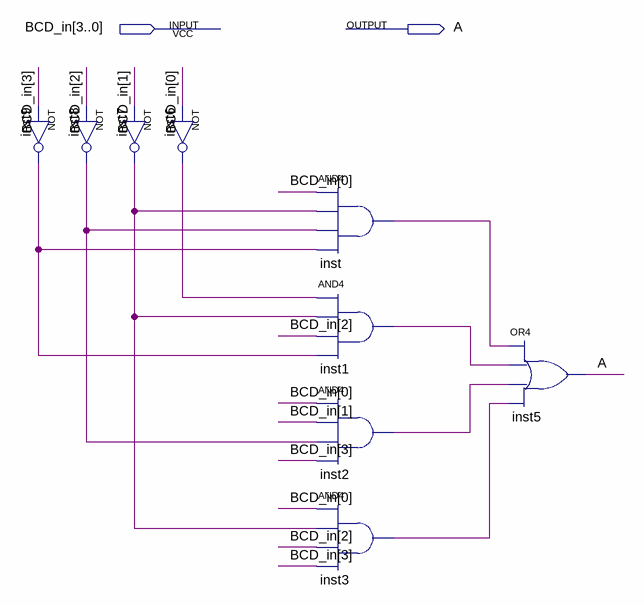
[diagram p0: schematic sheet]
// Quartus schematic ASegment.bdf as structural Verilog: 9 symbols, 2 pins
module ASegment (
  input  [3:0] BCD_in,
  output A
);

  wire inst1_out, inst2_out, inst3_out, inst6_out, inst7_out, inst8_out, inst9_out, inst_out;

  not inst9 (inst9_out, BCD_in[3]);
  not inst8 (inst8_out, BCD_in[2]);
  not inst6 (inst6_out, BCD_in[0]);
  not inst7 (inst7_out, BCD_in[1]);
  and inst (inst_out, BCD_in[0], inst7_out, inst8_out, inst9_out);
  and inst1 (inst1_out, inst6_out, inst7_out, BCD_in[2], inst9_out);
  and inst2 (inst2_out, BCD_in[0], BCD_in[1], inst8_out, BCD_in[3]);
  and inst3 (inst3_out, BCD_in[0], inst7_out, BCD_in[2], BCD_in[3]);
  or inst5 (A, inst_out, inst1_out, inst2_out, inst3_out);
endmodule
